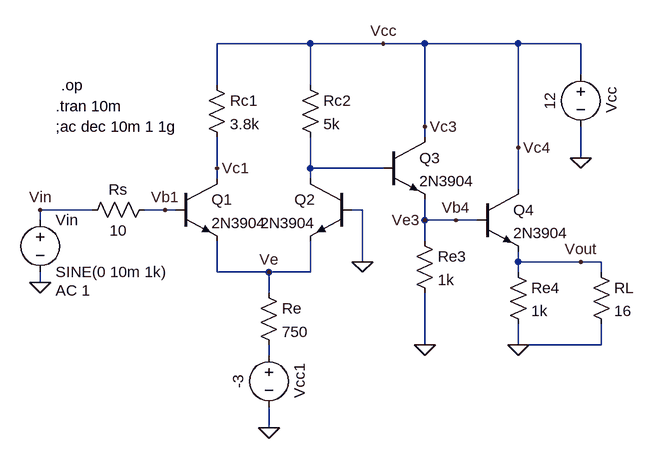
[diagram p0: schematic Differential Amplifier .asc]
Differential Amplifier .asc, the LTspice schematic file:
Version 4
SHEET 1 1224 680
WIRE 288 -112 144 -112
WIRE 400 -112 288 -112
WIRE 464 -112 400 -112
WIRE 608 -112 464 -112
WIRE 704 -112 608 -112
WIRE 704 -64 704 -112
WIRE 144 -48 144 -112
WIRE 288 -48 288 -112
WIRE 464 16 464 -112
WIRE 464 32 464 16
WIRE 608 48 608 -112
WIRE 704 64 704 16
WIRE 144 80 144 32
WIRE 288 80 288 32
WIRE 400 80 288 80
WIRE 144 96 144 80
WIRE 288 96 288 80
WIRE 608 112 608 48
WIRE -48 144 -128 144
WIRE 64 144 32 144
WIRE 80 144 64 144
WIRE 368 144 352 144
WIRE -128 160 -128 144
WIRE 464 160 464 128
WIRE 512 160 464 160
WIRE 544 160 512 160
WIRE 464 192 464 160
WIRE 368 224 368 144
WIRE 608 224 608 208
WIRE 704 224 608 224
WIRE 736 224 704 224
WIRE 144 240 144 192
WIRE 224 240 144 240
WIRE 288 240 288 192
WIRE 288 240 224 240
WIRE 608 240 608 224
WIRE 736 240 736 224
WIRE -128 256 -128 240
WIRE 224 272 224 240
WIRE 464 352 464 272
WIRE 608 352 608 320
WIRE 736 352 736 320
WIRE 736 352 608 352
WIRE 224 368 224 352
WIRE 224 480 224 448
FLAG -128 256 0
FLAG 224 480 0
FLAG 704 64 0
FLAG 368 224 0
FLAG 400 -112 Vcc
FLAG -128 144 Vin
FLAG 144 80 Vc1
FLAG 224 240 Ve
FLAG 464 16 Vc3
FLAG 608 48 Vc4
FLAG 512 160 Vb4
FLAG 464 160 Ve3
FLAG 64 144 Vb1
FLAG 704 224 Vout
FLAG 464 352 0
FLAG 608 352 0
DATAFLAG 640 224 ""
DATAFLAG 272 240 ""
DATAFLAG 368 176 ""
SYMBOL npn 80 96 R0
SYMATTR InstName Q1
SYMATTR Value 2N3904
SYMBOL npn 352 96 M0
SYMATTR InstName Q2
SYMATTR Value 2N3904
SYMBOL voltage -128 144 R0
WINDOW 123 24 124 Left 2
WINDOW 39 0 0 Left 0
SYMATTR Value2 AC 1
SYMATTR InstName Vin
SYMATTR Value SINE(0 10m 1k)
SYMBOL res 48 128 R90
WINDOW 0 0 56 VBottom 2
WINDOW 3 32 56 VTop 2
SYMATTR InstName Rs
SYMATTR Value 10
SYMBOL res 208 256 R0
SYMATTR InstName Re
SYMATTR Value 750
SYMBOL voltage 704 -80 R0
WINDOW 0 32 56 VTop 2
WINDOW 3 -32 56 VBottom 2
WINDOW 123 0 0 Left 0
WINDOW 39 0 0 Left 0
SYMATTR InstName Vcc
SYMATTR Value 12
SYMBOL res 128 -64 R0
SYMATTR InstName Rc1
SYMATTR Value 3.8k
SYMBOL res 272 -64 R0
SYMATTR InstName Rc2
SYMATTR Value 5k
SYMBOL voltage 224 352 R0
WINDOW 0 32 56 VTop 2
WINDOW 3 -32 56 VBottom 2
WINDOW 123 0 0 Left 0
WINDOW 39 0 0 Left 0
SYMATTR InstName Vcc1
SYMATTR Value -3
SYMBOL npn 400 32 R0
SYMATTR InstName Q3
SYMATTR Value 2N3904
SYMBOL npn 544 112 R0
SYMATTR InstName Q4
SYMATTR Value 2N3904
SYMBOL res 720 224 R0
SYMATTR InstName RL
SYMATTR Value 16
SYMBOL res 592 224 R0
SYMATTR InstName Re4
SYMATTR Value 1k
SYMBOL res 448 176 R0
SYMATTR InstName Re3
SYMATTR Value 1k
TEXT -104 -16 Left 2 !.tran 10m
TEXT -104 16 Left 2 !;ac dec 10m 1 1g
TEXT -96 -48 Left 2 !.op

The netlist it stands for:
* Differential Amplifier .asc
Q1 Vc1 Vb1 Ve 0 2N3904
Q2 N001 0 Ve 0 2N3904
Vin Vin 0 SINE(0 10m 1k) AC 1
Rs Vb1 Vin 10
Re Ve N002 750
Vcc Vc4 0 12
Rc1 Vc4 Vc1 3.8k
Rc2 Vc4 N001 5k
Vcc1 N002 0 -3
Q3 Vc4 N001 Ve3 0 2N3904
Q4 Vc4 Ve3 Vout 0 2N3904
RL Vout 0 16
Re4 Vout 0 1k
Re3 Ve3 0 1k
.model NPN NPN
.model PNP PNP
.lib standard.bjt
.tran 10m
;ac dec 10m 1 1g
.op
.backanno
.end